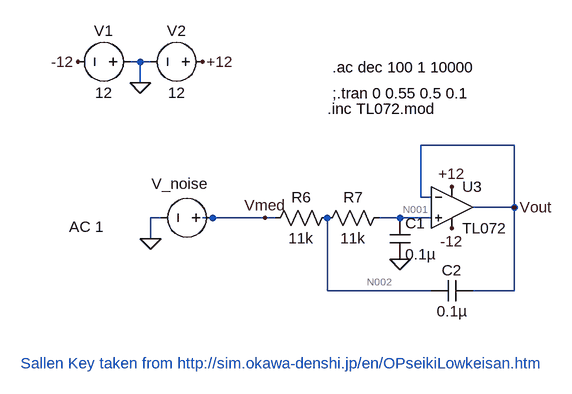
[diagram p0: schematic filter.asc]
filter.asc, the LTspice schematic file:
Version 4
SHEET 1 1708 680
WIRE 16 -144 0 -144
WIRE 32 -144 16 -144
WIRE 16 -112 16 -144
WIRE 592 -16 448 -16
WIRE 448 64 448 -16
WIRE 464 64 448 64
WIRE 592 80 592 -16
WIRE 592 80 528 80
WIRE 48 96 32 96
WIRE 128 96 112 96
WIRE 208 96 128 96
WIRE 224 96 208 96
WIRE 416 96 384 96
WIRE 464 96 416 96
WIRE 32 128 32 96
WIRE 304 208 304 96
WIRE 464 208 304 208
WIRE 592 208 592 80
WIRE 592 208 528 208
FLAG 16 -112 0
FLAG 112 -144 +12
FLAG -80 -144 -12
FLAG 496 112 -12
FLAG 496 48 +12
FLAG 416 160 0
FLAG 592 80 Vout
FLAG 208 96 Vmed
FLAG 32 128 0
SYMBOL voltage 16 -144 R90
WINDOW 0 -32 56 VBottom 2
WINDOW 3 32 56 VTop 2
WINDOW 123 0 0 Left 0
WINDOW 39 0 0 Left 0
SYMATTR InstName V1
SYMATTR Value 12
SYMBOL voltage 128 -144 R90
WINDOW 0 -32 56 VBottom 2
WINDOW 3 32 56 VTop 2
WINDOW 123 0 0 Left 0
WINDOW 39 0 0 Left 0
SYMATTR InstName V2
SYMATTR Value 12
SYMBOL Opamps\\opamp2 496 16 R0
SYMATTR InstName U3
SYMATTR Value TL072
SYMBOL res 400 80 R90
WINDOW 0 0 56 VBottom 2
WINDOW 3 32 56 VTop 2
SYMATTR InstName R7
SYMATTR Value 11k
SYMBOL res 320 80 R90
WINDOW 0 0 56 VBottom 2
WINDOW 3 32 56 VTop 2
SYMATTR InstName R6
SYMATTR Value 11k
SYMBOL cap 400 96 R0
SYMATTR InstName C1
SYMATTR Value 0.1µ
SYMBOL cap 528 192 R90
WINDOW 0 0 32 VBottom 2
WINDOW 3 32 32 VTop 2
SYMATTR InstName C2
SYMATTR Value 0.1µ
SYMBOL voltage 144 96 R90
WINDOW 0 -37 67 VBottom 2
WINDOW 3 -30 211 VTop 2
WINDOW 123 -2 211 VTop 2
WINDOW 39 0 0 Left 0
SYMATTR InstName V_noise
SYMATTR Value ""
SYMATTR Value2 AC 1
TEXT 312 -96 Left 2 !;.tran 0 0.55 0.5 0.1
TEXT 304 -72 Left 2 !.inc TL072.mod
TEXT -168 320 Left 2 ;Sallen Key taken from http://sim.okawa-denshi.jp/en/OPseikiLowkeisan.htm
TEXT 312 -136 Left 2 !.ac dec 100 1 10000

The netlist it stands for:
* filter.asc
V1 0 -12 12
V2 +12 0 12
XU3 N001 Vout +12 -12 Vout TL072  ; pins In+ In- V+ V- OUT
R7 N001 N002 11k
R6 N002 Vmed 11k
C1 N001 0 0.1µ
C2 Vout N002 0.1µ
V_noise Vmed 0 AC 1
;.tran 0 0.55 0.5 0.1
.inc TL072.mod
* Sallen Key taken from http://sim.okawa-denshi.jp/en/OPseikiLowkeisan.htm
.ac dec 100 1 10000
.backanno
.end

* Results of the author's LTspice run, read from the files saved beside the schematic
* Operating Point, zero values left out:
*   V(-12) = -12 V
*   V(+12) = 12 V
*   V(vout) = 10.05 µV
*   V(n001) = -925.2 nV
*   V(n002) = -462.6 nV
*   I(R6) = -42.05 pA
*   I(R7) = -42.05 pA
*   I(V_noise) = -42.05 pA
*   I(V2) = -11.39 mA
*   I(V1) = -11.39 mA
*   Ix(u3:1) = 42.05 pA
*   Ix(u3:2) = 42.05 pA
*   Ix(u3:3) = 11.39 mA
*   Ix(u3:4) = -11.39 mA
*   Ix(u3:5) = -42.05 pA
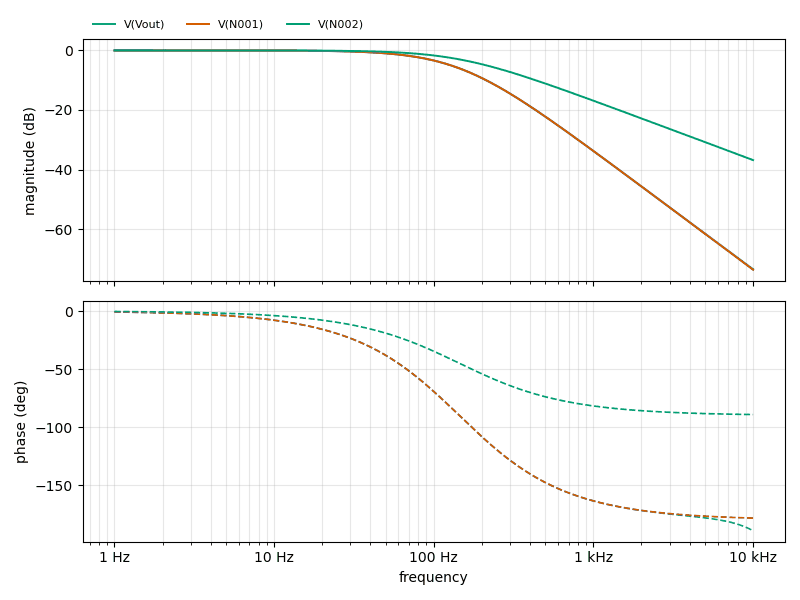
[diagram p1: AC Analysis of filter.asc, plotted from the saved traces]
* AC Analysis, 1 run:
*   V(Vout): -0.00 dB at 1 Hz, -73.46 dB at 10 kHz, peak -0.00 dB at 1 Hz, 3 dB below the peak at 93.12 Hz
*   V(N001): -0.00 dB at 1 Hz, -73.61 dB at 10 kHz, peak -0.00 dB at 1 Hz, 3 dB below the peak at 93.12 Hz
*   V(N002): -0.00 dB at 1 Hz, -36.82 dB at 10 kHz, peak -0.00 dB at 1 Hz, 3 dB below the peak at 144.7 Hz